# Altium schematic sheet Conectors_IsolatedSupply.SchDoc: Isolated power supply
size A4; CheckedBy: Hildo Guillardi Júnior; Author: Arthur; Organization: UNICAMP / LCEE; Address1: University of Campinas - Brazil; Address2: Power Conditioning Laboratory; Address3: Licensed by GNU GPL 3.0; ProjectName: Easy Inverter
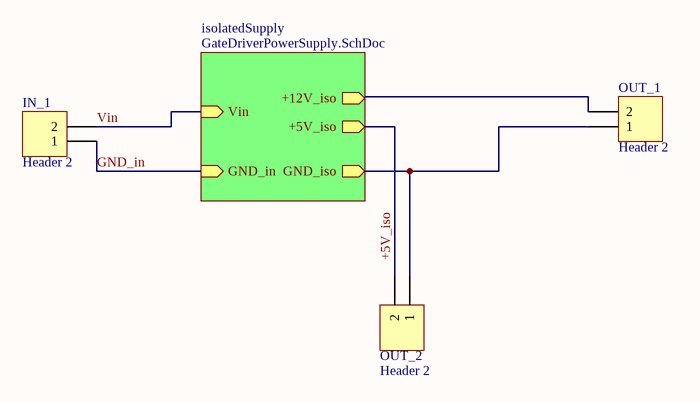
[diagram p0: Conectors_IsolatedSupply.SchDoc]

## Parts
IN_1  Header 2  [Header2]
OUT_1  Header 2  [Header2]
OUT_2  Header 2  [Header2]

## Sub-sheets
isolatedSupply = GateDriverPowerSupply.SchDoc: +12V_iso (out), +5V_iso (out), GND_iso (out), GND_in (in), Vin (in)

## Nets
+5V_iso: OUT_2.2 ; sheet isolatedSupply/+5V_iso
GND_in: IN_1.1 ; sheet isolatedSupply/GND_in
Vin: IN_1.2 ; sheet isolatedSupply/Vin
NetOUT_1_1: OUT_1.1 OUT_2.1 ; sheet isolatedSupply/GND_iso

Not connected (* = marked no-connect by the designer): OUT_1 2

## Notes on the sheet
- Title
- Author
- Revisor
- Hildo G Jr
- Revision:
- Sheet
- of
- File:
- Size:
- A4
- HGJr

## Library data of the parts
IN_1 = Header 2: Header, 2-Pin; pn: 1935161
OUT_1 OUT_2 = Header 2: Header, 2-Pin